# Altium project VENTUNOQ.PrjPcb (part 11 of 18)

## Sheet MIPI_FLAT_22PIN.SchDoc: MIPI FLAT 22 PIN
size A3; Author: Silvio Navaretti; CompanyName: ARDUINO; DrawnBy: Silvio Navaretti; Engineer: Silvio Navaretti; Organization: ARDUINO; SheetNumber: 43; SheetTotal: 51; RevAuthor: Silvio Navaretti
Used 3 times, as channels U_MIPI/U_MIPI_FLAT_22PIN, U_MIPI/U_MIPI_FLAT_22PIN, U_MIPI/U_MIPI_FLAT_22PIN. Parts and nets are listed once, with the designators drawn on the sheet.
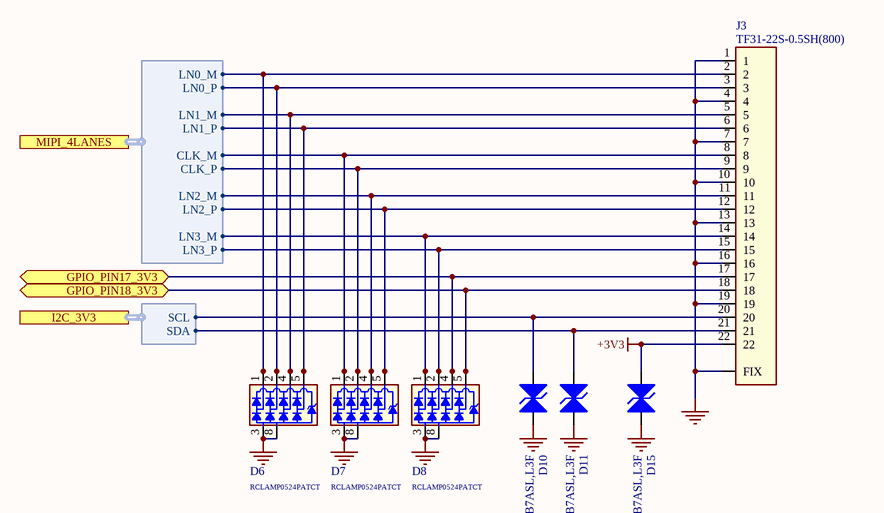
[diagram p33: MIPI_FLAT_22PIN.SchDoc]

### Parts
D6  RCLAMP0524PATCT  [SLP2510P8]
D7  RCLAMP0524PATCT  [SLP2510P8]
D8  RCLAMP0524PATCT  [SLP2510P8]
D10  DF2B7ASL,L3F  [DF2B7ASL,L3F]
D11  DF2B7ASL,L3F  [DF2B7ASL,L3F]
D15  DF2B7ASL,L3F  [DF2B7ASL,L3F]
J3  TF31-22S-0.5SH(800)  [TF31-22S-0.5SH(800)]

### Ports
GPIO_PIN17_3V3 (bidir), GPIO_PIN18_3V3 (bidir), I2C_3V3 (harness I2C), MIPI_4LANES (harness MIPI_4LANES)

### Harnesses
MIPI_4LANES: LN3_M, LN2_M, LN2_P, LN0_M, LN0_P, CLK_M, CLK_P, LN1_M, LN1_P, LN3_P
I2C: SDA, SCL

### Nets
+3V3: D15.2(A2) J3.22
GND: D6.3 D6.8 D7.3 D7.8 D8.3 D8.8 D10.1(A1) D11.1(A1) D15.1(A1) J3.1 J3.4 J3.7 J3.10 J3.13 J3.16 J3.19 J3.FIX
GPIO_PIN17_3V3: D8.4 D8.7 J3.17 ; port GPIO_PIN17_3V3
GPIO_PIN18_3V3: D8.5 D8.6 J3.18 ; port GPIO_PIN18_3V3
NetD6_1: D6.1 D6.10 J3.2 ; port MIPI_4LANES.LN0_M
NetD6_2: D6.2 D6.9 J3.3 ; port MIPI_4LANES.LN0_P
NetD6_4: D6.4 D6.7 J3.5 ; port MIPI_4LANES.LN1_M
NetD6_5: D6.5 D6.6 J3.6 ; port MIPI_4LANES.LN1_P
NetD7_1: D7.1 D7.10 J3.8 ; port MIPI_4LANES.CLK_M
NetD7_2: D7.2 D7.9 J3.9 ; port MIPI_4LANES.CLK_P
NetD7_4: D7.4 D7.7 J3.11 ; port MIPI_4LANES.LN2_M
NetD7_5: D7.5 D7.6 J3.12 ; port MIPI_4LANES.LN2_P
NetD8_1: D8.1 D8.10 J3.14 ; port MIPI_4LANES.LN3_M
NetD8_2: D8.2 D8.9 J3.15 ; port MIPI_4LANES.LN3_P
NetD10_2: D10.2(A2) J3.20 ; port I2C_3V3.SCL
NetD11_2: D11.2(A2) J3.21 ; port I2C_3V3.SDA

### Channels
U_MIPI/U_MIPI_FLAT_22PIN: designators end in _1; ports GPIO_PIN17_3V3=FLAT1_GPIO_PIN17_3V3 GPIO_PIN18_3V3=NetD8_1_5
U_MIPI/U_MIPI_FLAT_22PIN: designators end in _2; ports GPIO_PIN17_3V3=FLAT0_GPIO_PIN17_3V3 GPIO_PIN18_3V3=NetD8_2_5
U_MIPI/U_MIPI_FLAT_22PIN: designators end in _3; ports GPIO_PIN17_3V3=FLAT2_GPIO_PIN17_3V3 GPIO_PIN18_3V3=NetD8_3_5

### Notes on the sheet
- Title:
- ID:
- Date:
- Time:
- Version:
- Sheet
- of
- RevAuthor:
- Reference Designs ARE PROVIDED "AS IS" AND "WITH ALL FAULTS. Arduino SA DISCLAIMS ALL OTHER WARRANTIES, EXPRESS OR IMPLIED, REGARDING PRODUCTS, INCLUDING BUT NOT LIMITED TO, ANY IMPLIED WARRANTIES OF MERCHANTABILITY OR FITNESS FOR A PARTICULAR PURPOSE.
  Arduino SA may make changes to specifications and product descriptions at any time, without notice. The Customer must not rely on the absence or characteristics of any features or instructions marked "reserved" or "undefined".
  Arduino SA reserves these for future definition and shall have no responsibility whatsoever for conflicts or incompatibilities arising from future changes to them. The product information on the Web Site or Materials is subject to change without notice.
  Do not finalize a design with this info. ARDUINO and other Arduino brands and logos and Trademarks of Arduino SA. All Arduino SA Trademarks cannot be used without owner's formal permission.
- File:
- Author:

### Library data of the parts
D6-D8 = D0097-A.6: as D13 on sheet HDMI_CONNECTOR; Part Number: RCLAMP0524PATCT
D10 D11 D15 = D0099-5: as D12 on sheet HDMI_CONNECTOR; V(BR) min: 5.8V; V(RWM) max: 5.5V; Part Number: DF2B7ASL,L3F
J3 = J0553-A.2: CONN FFC/FPC Connector, 22 Contact(s), 1 Row(s), BOTTOM CONTACT, Female, Right Angle, 0.5mm Pitch; Manufacturer: Hirose; Code Arduino: J0553; Part Number: TF31-22S-0.5SH(800)

## Sheet PUSHBUTTONS.SchDoc: PUSHBUTTON
size A3; Author: Silvio Navaretti; CompanyName: ARDUINO; DrawnBy: Silvio Navaretti; Engineer: Silvio Navaretti; Organization: ARDUINO; SheetNumber: 49; SheetTotal: 51; RevAuthor: Silvio Navaretti
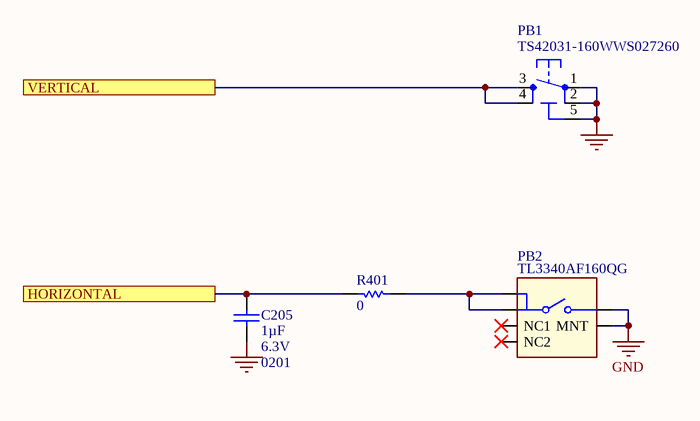
[diagram p34: PUSHBUTTONS.SchDoc]

### Parts
C205  value 1µF  Voltage: 6.3V  Case Code (Imperial): 0201  [CAP-0201]  (hidden comment: GRM033R60J105MEA2D)
PB1  TS42031-160WWS027260  [TS42]
PB2  TL3340AF160QG  [TL3340AF160QG-Footprint-1]
R401  value 0  [RES-0201]  (hidden comment: CRCW02010000Z0ED)

### Ports
HORIZONTAL, VERTICAL

### Nets
GND: C205.1 PB1.1 PB1.2 PB1.5(5-GND) PB2.2 PB2.MNT
MD_GPIO_79: C205.2 R401.1 ; port HORIZONTAL
NetPB1_3: PB1.3 PB1.4 ; port VERTICAL
NetPB2_1: PB2.1 PB2.3 R401.2

Not connected (* = marked no-connect by the designer): PB2 NC1* NC2*

### Notes on the sheet
- Title:
- ID:
- Date:
- Time:
- Version:
- Sheet
- of
- RevAuthor:
- Reference Designs ARE PROVIDED "AS IS" AND "WITH ALL FAULTS. Arduino SA DISCLAIMS ALL OTHER WARRANTIES, EXPRESS OR IMPLIED, REGARDING PRODUCTS, INCLUDING BUT NOT LIMITED TO, ANY IMPLIED WARRANTIES OF MERCHANTABILITY OR FITNESS FOR A PARTICULAR PURPOSE.
  Arduino SA may make changes to specifications and product descriptions at any time, without notice. The Customer must not rely on the absence or characteristics of any features or instructions marked "reserved" or "undefined".
  Arduino SA reserves these for future definition and shall have no responsibility whatsoever for conflicts or incompatibilities arising from future changes to them. The product information on the Web Site or Materials is subject to change without notice.
  Do not finalize a design with this info. ARDUINO and other Arduino brands and logos and Trademarks of Arduino SA. All Arduino SA Trademarks cannot be used without owner's formal permission.
- File:
- Author:

### Library data of the parts
C205 = C0002-A.15: as C109 on sheet AUDIO_CODEC; Tolerance: 20%; Dielectric: X5R; Part Number: GRM033R60J105MEA2D; Technology: Ceramic
PB1 = B0005-A.11: PUSHBUTTON SMD 6x6 5 PINS; Manufacturer: C&K; Code Arduino: 0946; Part Number: TS42031-160WWS027260
PB2 = B0013-A.8: PUSHBUTTON SMD VERTICAL ANCHORS 4x3.4mm; Manufacturer: E-Switch; Code Arduino: B0013; Max Operating Temperature: 85°C; Mount: Surface Mount; Min Operating Temperature: -35°C; Part Number: TL3340AF160QG
R401 = R0140-A.21: RES CHIP 0201 0R; Manufacturer: Vishay; Tolerance: 0%; Temperature coefficient: 0ppm; Power: 50mW; Code Arduino: R0140; Part Number: CRCW02010000Z0ED; Case Code (Imperial): 0201; Technology: Thick film

## Sheet HEADERS_JOMEGA.SchDoc: JOMEGA
size A3; Author: Silvio Navaretti; CompanyName: ARDUINO; DrawnBy: Silvio Navaretti; Engineer: Silvio Navaretti; Organization: ARDUINO; SheetNumber: 22; SheetTotal: 51; RevAuthor: Silvio Navaretti
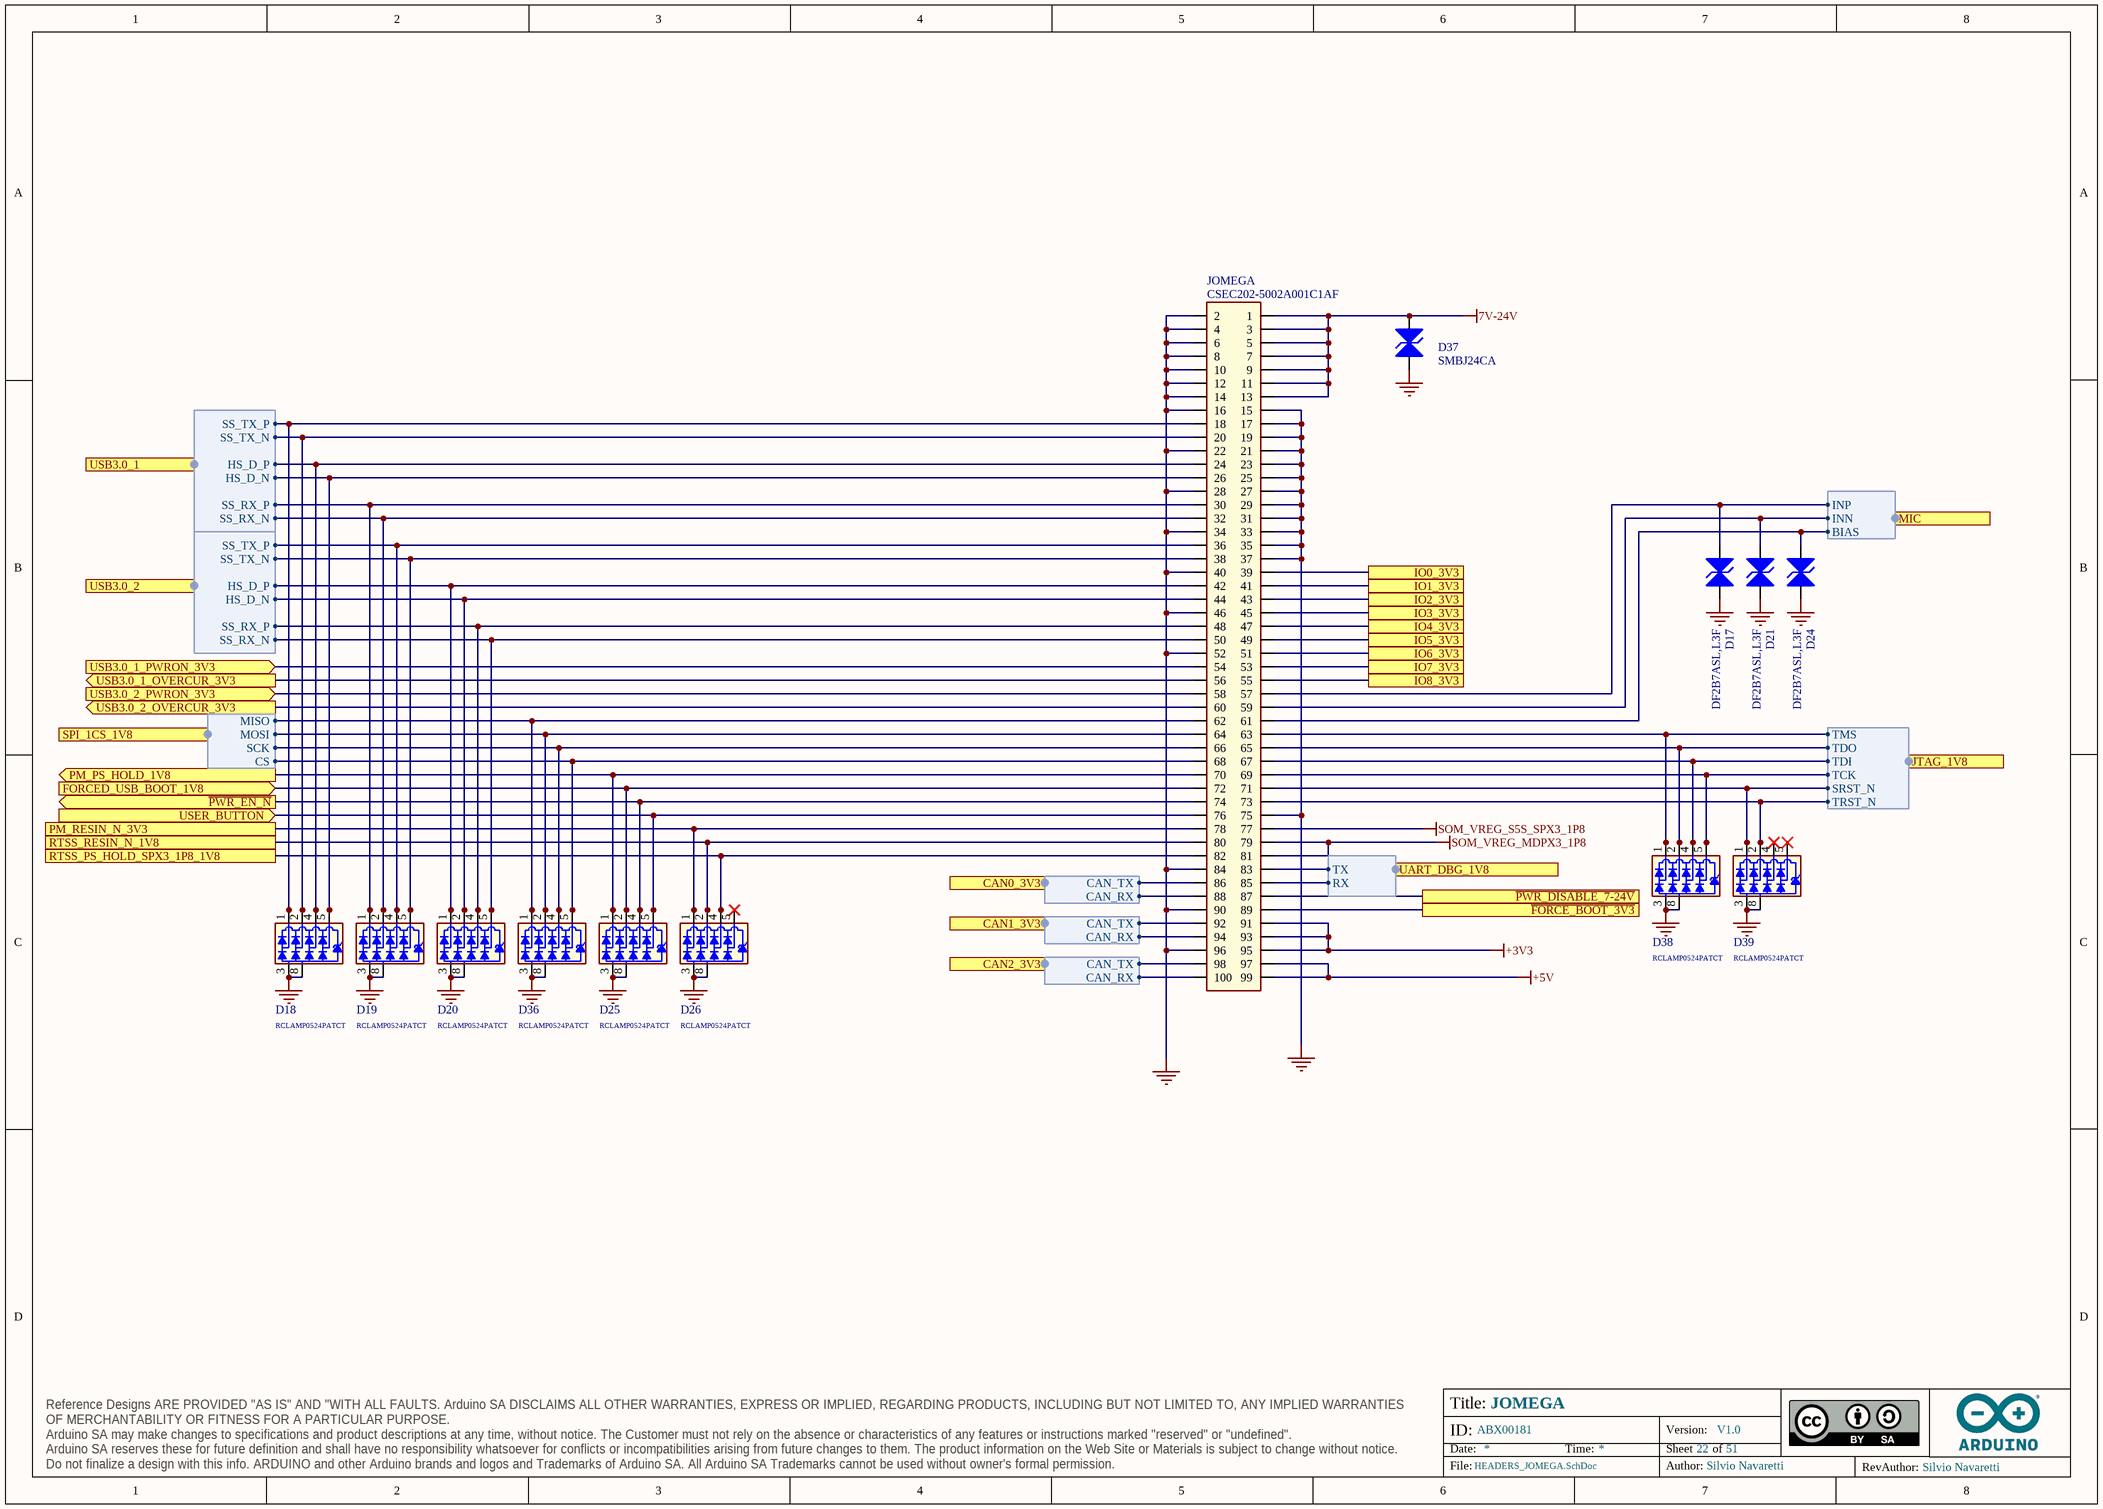
[diagram p35: HEADERS_JOMEGA.SchDoc]

### Parts
D17  DF2B7ASL,L3F  [DF2B7ASL,L3F]
D18  RCLAMP0524PATCT  [SLP2510P8]
D19  RCLAMP0524PATCT  [SLP2510P8]
D20  RCLAMP0524PATCT  [SLP2510P8]
D21  DF2B7ASL,L3F  [DF2B7ASL,L3F]
D24  DF2B7ASL,L3F  [DF2B7ASL,L3F]
D25  RCLAMP0524PATCT  [SLP2510P8]
D26  RCLAMP0524PATCT  [SLP2510P8]
D36  RCLAMP0524PATCT  [SLP2510P8]
D37  SMBJ24CA  [SMB_NOPOLARITY]
D38  RCLAMP0524PATCT  [SLP2510P8]
D39  RCLAMP0524PATCT  [SLP2510P8]
JOMEGA  CSEC202-5002A001C1AF  [CSEC202-5002A001C1AF]

### Ports
CAN0_3V3 (out, harness CAN), CAN1_3V3 (out, harness CAN), CAN2_3V3 (out, harness CAN), FORCED_USB_BOOT_1V8 (in), IO0_3V3, IO1_3V3, IO2_3V3, IO3_3V3, IO4_3V3, IO5_3V3, IO6_3V3, IO7_3V3, IO8_3V3, JTAG_1V8 (out, harness SOM_SAIL_JTAG), MIC (out, harness MIC), PM_PS_HOLD_1V8 (out), PM_RESIN_N_3V3, RTSS_PS_HOLD_SPX3_1P8_1V8, RTSS_RESIN_N_1V8, SPI_1CS_1V8 (in, harness SPI), UART_DBG_1V8 (harness UART), USB3.0_1 (out, harness SOM_MD_USB0), USB3.0_1_OVERCUR_3V3 (out), USB3.0_1_PWRON_3V3 (in), USB3.0_2 (out, harness SOM_MD_USB0), USB3.0_2_OVERCUR_3V3 (out), USB3.0_2_PWRON_3V3 (in), USER_BUTTON (in), ~{FORCE_BOOT_3V3}, ~{PWR_DISABLE_7-24V}, ~{PWR_EN_N} (out)

### Harnesses
MIC: INP, INN, BIAS
SOM_SAIL_JTAG: TMS, TDO, TDI, TCK, SRST_N, TRST_N
SOM_MD_USB0: SS_TX_N, SS_TX_P, HS_D_P, HS_D_N, SS_RX_P, SS_RX_N
SPI: SCK, MISO, MOSI, CS
CAN: CAN_TX, CAN_RX
UART: TX, RX

### Nets
7V-24V: D37.2(A2) JOMEGA.1 JOMEGA.3 JOMEGA.5 JOMEGA.7 JOMEGA.9 JOMEGA.11 JOMEGA.13
+3V3: JOMEGA.91 JOMEGA.93 JOMEGA.95
+5V: JOMEGA.97 JOMEGA.99
GND: D17.1(A1) D18.3 D18.8 D19.3 D19.8 D20.3 D20.8 D21.1(A1) D24.1(A1) D25.3 D25.8 D26.3 D26.8 D36.3 D36.8 D37.1(A1) D38.3 D38.8 D39.3 D39.8 JOMEGA.2 JOMEGA.4 JOMEGA.6 JOMEGA.8 JOMEGA.10 JOMEGA.12 JOMEGA.14 JOMEGA.15 JOMEGA.16 JOMEGA.17 JOMEGA.19 JOMEGA.21 JOMEGA.22 JOMEGA.23 JOMEGA.25 JOMEGA.27 JOMEGA.28 JOMEGA.29 JOMEGA.31 JOMEGA.33 JOMEGA.34 JOMEGA.35 JOMEGA.37 JOMEGA.40 JOMEGA.46 JOMEGA.52 JOMEGA.75 JOMEGA.84 JOMEGA.90 JOMEGA.96
SOM_VREG_MDPX3_1P8: JOMEGA.79 JOMEGA.81
SOM_VREG_S5S_SPX3_1P8: JOMEGA.77
FORCE_BOOT_3V3: JOMEGA.89 ; port ~{FORCE_BOOT_3V3}
MD_GPIO_37: D36.4 D36.7 JOMEGA.66 ; port SPI_1CS_1V8.SCK
MD_GPIO_38: D36.5 D36.6 JOMEGA.68 ; port SPI_1CS_1V8.CS
MD_GPIO_39: D36.1 D36.10 JOMEGA.62 ; port SPI_1CS_1V8.MISO
MD_GPIO_40: D36.2 D36.9 JOMEGA.64 ; port SPI_1CS_1V8.MOSI
MD_GPIO_43: JOMEGA.83 ; port UART_DBG_1V8.TX
MD_GPIO_44: JOMEGA.85 ; port UART_DBG_1V8.RX
MD_GPIO_52: D25.2 D25.9 JOMEGA.72 ; port FORCED_USB_BOOT_1V8
MD_GPIO_79: D25.5 D25.6 JOMEGA.76 ; port USER_BUTTON
MIC_IN5_IN6.BIAS: D24.2(A2) JOMEGA.61 ; port MIC.BIAS
MIC_IN5_IN6.INN: D21.2(A2) JOMEGA.59 ; port MIC.INN
MIC_IN5_IN6.INP: D17.2(A2) JOMEGA.57 ; port MIC.INP
~{PM_RESIN_N_3V3}: D26.1 D26.10 JOMEGA.78 ; port PM_RESIN_N_3V3
~{POWER_DISABLE_7-24V}: JOMEGA.87 ; port ~{PWR_DISABLE_7-24V}
~{PWR_EN_N_3V3}: D25.4 D25.7 JOMEGA.74 ; port ~{PWR_EN_N}
PA10: JOMEGA.92 ; port CAN1_3V3.CAN_TX
PC0: JOMEGA.39 ; port IO0_3V3
PC1: JOMEGA.41 ; port IO1_3V3
PC2: JOMEGA.43 ; port IO2_3V3
PC3: JOMEGA.45 ; port IO3_3V3
PD5: JOMEGA.86 ; port CAN0_3V3.CAN_TX
PD9: JOMEGA.94 ; port CAN1_3V3.CAN_RX
PD12: JOMEGA.47 ; port IO4_3V3
PD13: JOMEGA.49 ; port IO5_3V3
PD14: JOMEGA.51 ; port IO6_3V3
PD15: JOMEGA.53 ; port IO7_3V3
PF6: JOMEGA.98 ; port CAN2_3V3.CAN_TX
PF7: JOMEGA.100 ; port CAN2_3V3.CAN_RX
PI2: JOMEGA.55 ; port IO8_3V3
PI9: JOMEGA.88 ; port CAN0_3V3.CAN_RX
PM_PS_HOLD: D25.1 D25.10 JOMEGA.70 ; port PM_PS_HOLD_1V8
RTSS_PS_HOLD_SPX3_1P8: D26.4 D26.7 JOMEGA.82 ; port RTSS_PS_HOLD_SPX3_1P8_1V8
RTSS_RESIN_N: D26.2 D26.9 JOMEGA.80 ; port RTSS_RESIN_N_1V8
SAIL_JTAG.SRST_N: D39.1 D39.10 JOMEGA.71 ; port JTAG_1V8.SRST_N
SAIL_JTAG.TCK: D38.5 D38.6 JOMEGA.69 ; port JTAG_1V8.TCK
SAIL_JTAG.TDI: D38.4 D38.7 JOMEGA.67 ; port JTAG_1V8.TDI
SAIL_JTAG.TDO: D38.2 D38.9 JOMEGA.65 ; port JTAG_1V8.TDO
SAIL_JTAG.TMS: D38.1 D38.10 JOMEGA.63 ; port JTAG_1V8.TMS
SAIL_JTAG.TRST_N: D39.2 D39.9 JOMEGA.73 ; port JTAG_1V8.TRST_N
USB1_CAP_SSTX_N: D18.2 D18.9 JOMEGA.20 ; port USB3.0_1.SS_TX_N
USB1_CAP_SSTX_P: D18.1 D18.10 JOMEGA.18 ; port USB3.0_1.SS_TX_P
USB1_D_N: D18.5 D18.6 JOMEGA.26 ; port USB3.0_1.HS_D_N
USB1_D_P: D18.4 D18.7 JOMEGA.24 ; port USB3.0_1.HS_D_P
USB1_SSRX_N: D19.2 D19.9 JOMEGA.32 ; port USB3.0_1.SS_RX_N
USB1_SSRX_P: D19.1 D19.10 JOMEGA.30 ; port USB3.0_1.SS_RX_P
USB3_CAP_SSTX_N: D19.5 D19.6 JOMEGA.38 ; port USB3.0_2.SS_TX_N
USB3_CAP_SSTX_P: D19.4 D19.7 JOMEGA.36 ; port USB3.0_2.SS_TX_P
USB3_D_N: D20.2 D20.9 JOMEGA.44 ; port USB3.0_2.HS_D_N
USB3_D_P: D20.1 D20.10 JOMEGA.42 ; port USB3.0_2.HS_D_P
USB3_SSRX_N: D20.5 D20.6 JOMEGA.50 ; port USB3.0_2.SS_RX_N
USB3_SSRX_P: D20.4 D20.7 JOMEGA.48 ; port USB3.0_2.SS_RX_P
NetD26_5: D26.5 D26.6
NetD39_4: D39.4 D39.7
NetD39_5: D39.5 D39.6
NetJOMEGA_54: JOMEGA.54 ; port USB3.0_1_PWRON_3V3
NetJOMEGA_56: JOMEGA.56 ; port USB3.0_1_OVERCUR_3V3
NetJOMEGA_58: JOMEGA.58 ; port USB3.0_2_PWRON_3V3
NetJOMEGA_60: JOMEGA.60 ; port USB3.0_2_OVERCUR_3V3

### Notes on the sheet
- Title:
- ID:
- Date:
- Time:
- Version:
- Sheet
- of
- RevAuthor:
- Reference Designs ARE PROVIDED "AS IS" AND "WITH ALL FAULTS. Arduino SA DISCLAIMS ALL OTHER WARRANTIES, EXPRESS OR IMPLIED, REGARDING PRODUCTS, INCLUDING BUT NOT LIMITED TO, ANY IMPLIED WARRANTIES OF MERCHANTABILITY OR FITNESS FOR A PARTICULAR PURPOSE.
  Arduino SA may make changes to specifications and product descriptions at any time, without notice. The Customer must not rely on the absence or characteristics of any features or instructions marked "reserved" or "undefined".
  Arduino SA reserves these for future definition and shall have no responsibility whatsoever for conflicts or incompatibilities arising from future changes to them. The product information on the Web Site or Materials is subject to change without notice.
  Do not finalize a design with this info. ARDUINO and other Arduino brands and logos and Trademarks of Arduino SA. All Arduino SA Trademarks cannot be used without owner's formal permission.
- File:
- Author:

### Library data of the parts
D17 D21 D24 = D0099-5: as D12 on sheet HDMI_CONNECTOR; V(BR) min: 5.8V; V(RWM) max: 5.5V; Part Number: DF2B7ASL,L3F
D18-D20 D25 D26 D36 D38 D39 = D0097-A.6: as D13 on sheet HDMI_CONNECTOR; Part Number: RCLAMP0524PATCT
D37 = D0070-A.2: TVS BIDIRECTIONAL SMD Vr 24V, Vbr min 26.7V, 600W, SMB; Manufacturer: Littlefuse; V(BR) Typ (V): 26.7; Code Arduino: D0070; Manufacturer 2: Bourns; Part Number: SMBJ24CA; Manufacturer 3: Hottech
JOMEGA = J0574-A.2: CONN HEADER FEMALE VERTICAL SMD 1.27mm 2x50 POS heigth 4.4mm; Manufacturer: Greenconn; Code Arduino: J0574; Part Number: CSEC202-5002A001C1AF